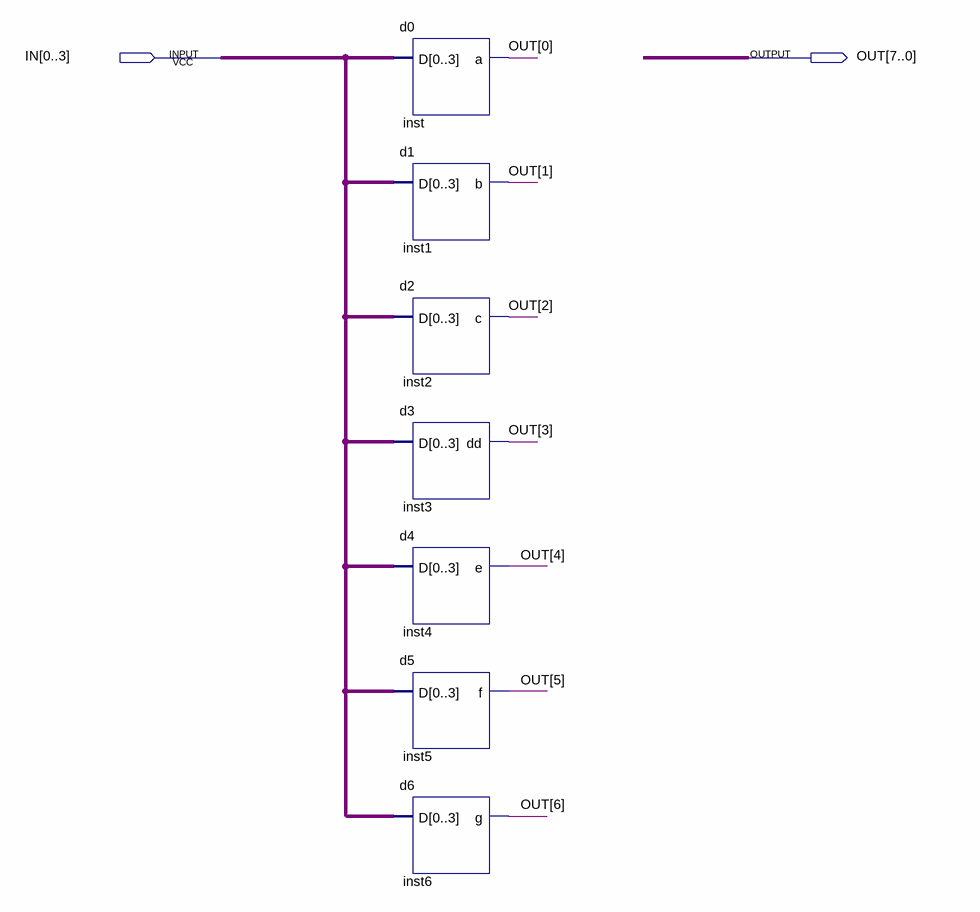
[diagram p0: schematic sheet]
// Quartus schematic displaycomplete.bdf as structural Verilog: 7 symbols, 2 pins
module displaycomplete (
  input  [0:3] IN,
  output [7:0] OUT
);

  d0 inst (.D(IN), .a(OUT[0]));
  d1 inst1 (.D(IN), .b(OUT[1]));
  d2 inst2 (.D(IN), .c(OUT[2]));
  d3 inst3 (.D(IN), .dd(OUT[3]));
  d4 inst4 (.D(IN), .e(OUT[4]));
  d5 inst5 (.D(IN), .f(OUT[5]));
  d6 inst6 (.D(IN), .g(OUT[6]));
endmodule
